# EAGLE schematic boiler_explorer (EAGLE 6.3)
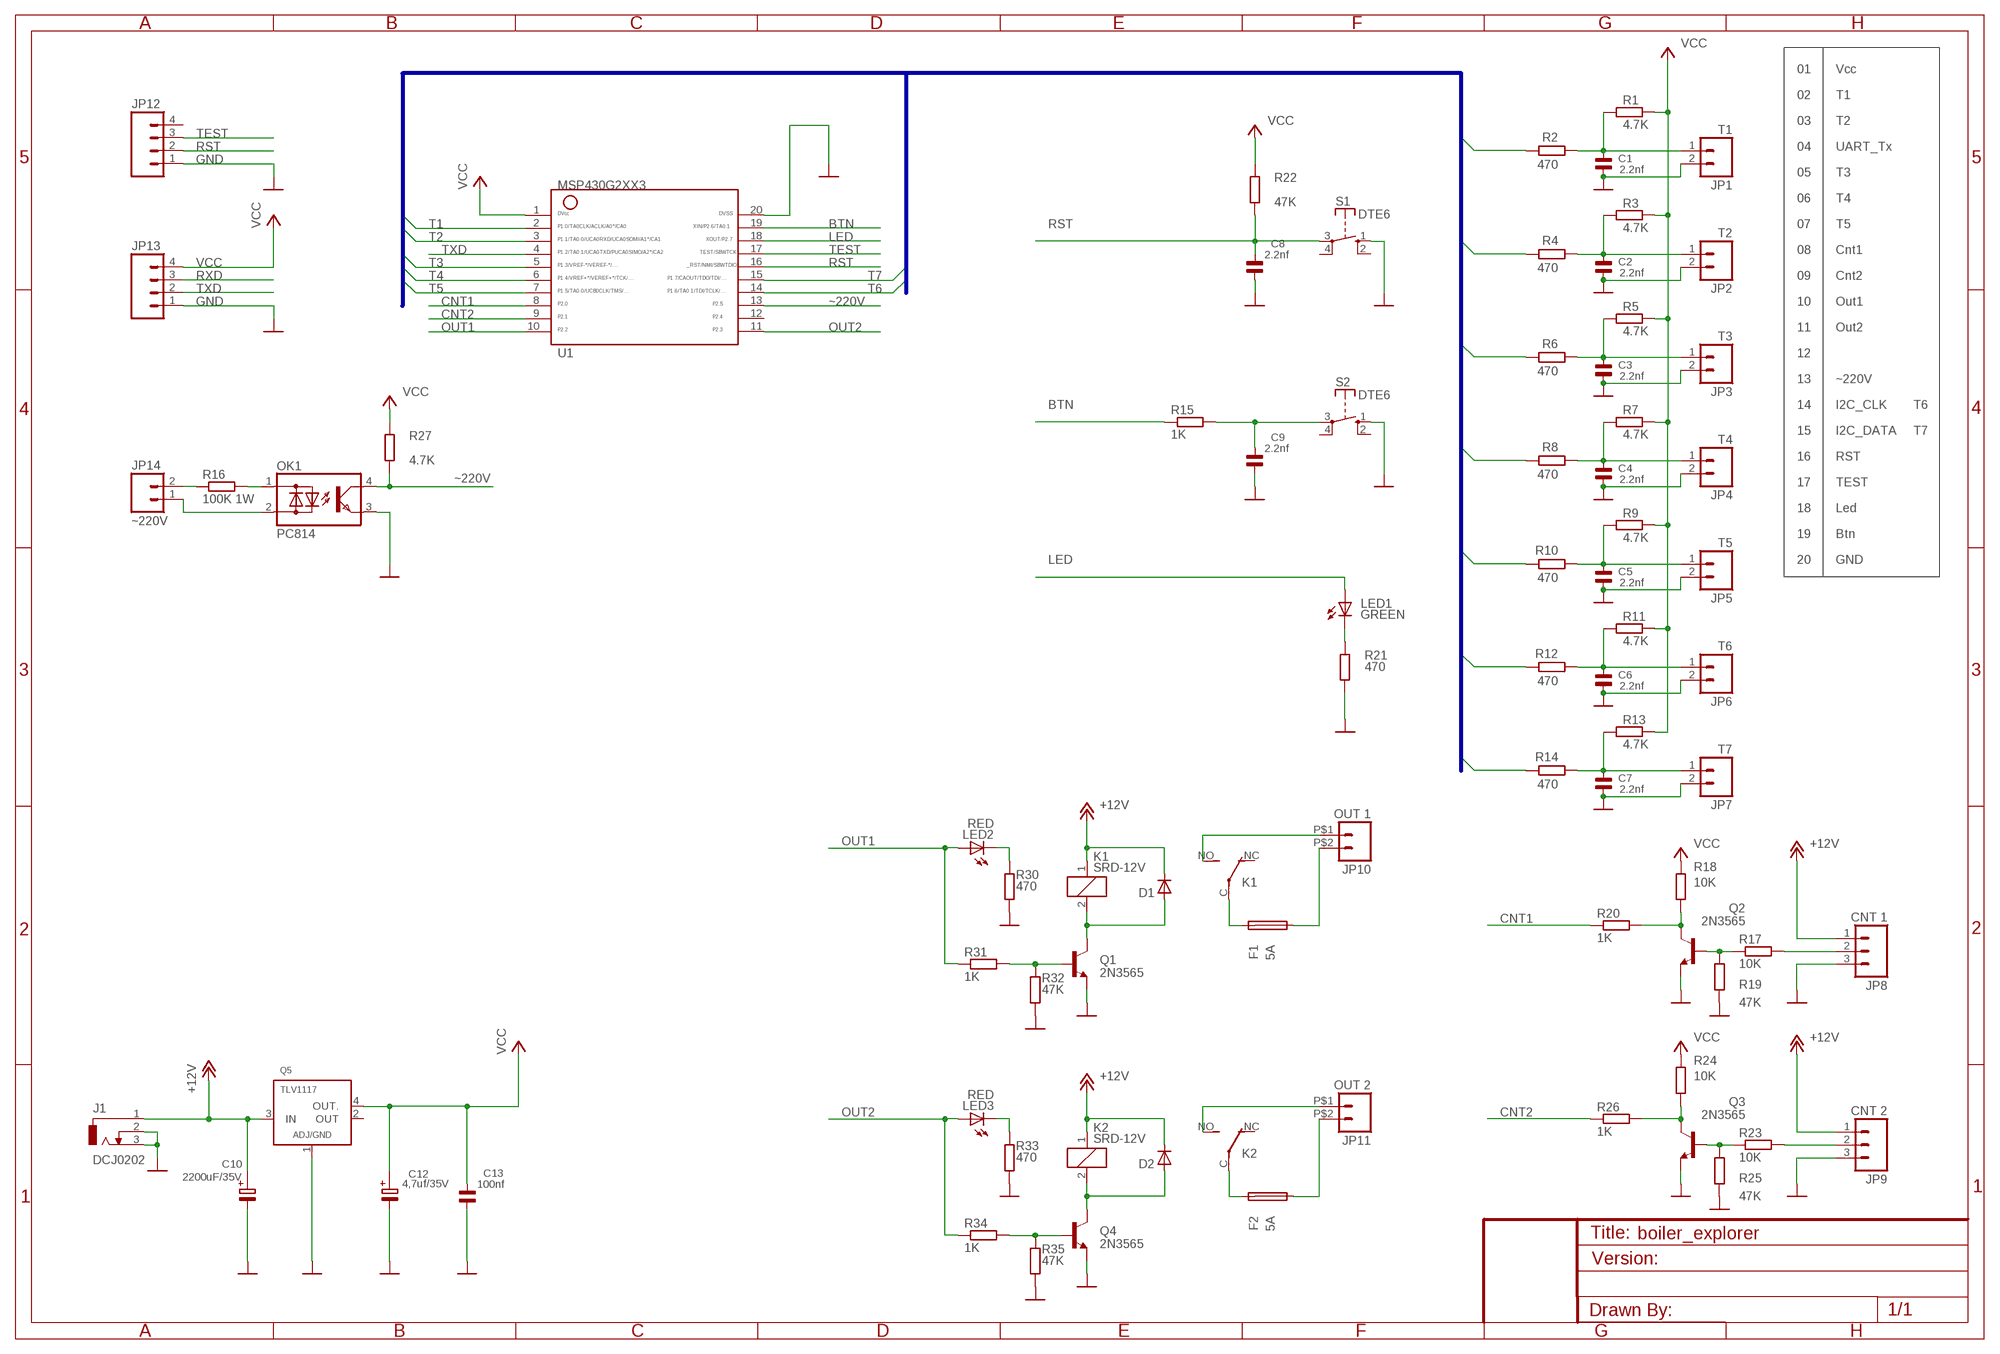
[diagram p0: schematic, sheet 1]

## Parts
C1  2.2nf  C5B2,5A  [C5B2,5A]
C2  2.2nf  C5B2,5A  [C5B2,5A]
C3  2.2nf  C5B2,5A  [C5B2,5A]
C4  2.2nf  C5B2,5A  [C5B2,5A]
C5  2.2nf  C5B2,5A  [C5B2,5A]
C6  2.2nf  C5B2,5A  [C5B2,5A]
C7  2.2nf  C5B2,5A  [C5B2,5A]
C8  2.2nf  C5B2,5A  [C5B2,5A]
C9  2.2nf  C5B2,5A  [C5B2,5A]
C10  2200uF/35V  E35-16  [E35-16]
C12  4,7uf/35V  E2-5@1  [E2,5-5]
C13  100nf  C5B2,5A  [C5B2,5A]
D1  DIODE-SMB  [SMB]
D2  DIODE-SMB  [SMB]
F1  5A  FUSEBLANK_5X20MM  [FUSE_HOLDER_5X20MM]
F2  5A  FUSEBLANK_5X20MM  [FUSE_HOLDER_5X20MM]
J1  DCJ0202  [DCJ0202]
JP1  T1  M025MM  [SCREWTERMINAL-5MM-2]
JP2  T2  M025MM  [SCREWTERMINAL-5MM-2]
JP3  T3  M025MM  [SCREWTERMINAL-5MM-2]
JP4  T4  M025MM  [SCREWTERMINAL-5MM-2]
JP5  T5  M025MM  [SCREWTERMINAL-5MM-2]
JP6  T6  M025MM  [SCREWTERMINAL-5MM-2]
JP7  T7  M025MM  [SCREWTERMINAL-5MM-2]
JP8  CNT 1  M03POLAR_LOCK  [MOLEX-1X3_LOCK]
JP9  CNT 2  M03POLAR_LOCK  [MOLEX-1X3_LOCK]
JP10  OUT 1  M02PTH2  [1X02_BIG]
JP11  OUT 2  M02PTH2  [1X02_BIG]
JP12  M04PTH  [1X04]
JP13  M04PTH  [1X04]
JP14  ~220V  M025MM  [SCREWTERMINAL-5MM-2]
K1  SRD-12V  JS-M1-12V-5  [SRD]
K2  SRD-12V  JS-M1-12V-5  [SRD]
LED1  GREEN  LEDCHIP-LED0805  [CHIP-LED0805]
LED2  RED  LEDCHIP-LED0805  [CHIP-LED0805]
LED3  RED  LEDCHIP-LED0805  [CHIP-LED0805]
OK1  PC814  [DIL04]
Q1  2N3565  [TO92]
Q2  2N3565  [TO92]
Q3  2N3565  [TO92]
Q4  2N3565  [TO92]
Q5  TLV1117  [SOT223-4]
R1  4.7K  R-EU_R0805  [R0805]
R2  470  R-EU_R0805  [R0805]
R3  4.7K  R-EU_R0805  [R0805]
R4  470  R-EU_R0805  [R0805]
R5  4.7K  R-EU_R0805  [R0805]
R6  470  R-EU_R0805  [R0805]
R7  4.7K  R-EU_R0805  [R0805]
R8  470  R-EU_R0805  [R0805]
R9  4.7K  R-EU_R0805  [R0805]
R10  470  R-EU_R0805  [R0805]
R11  4.7K  R-EU_R0805  [R0805]
R12  470  R-EU_R0805  [R0805]
R13  4.7K  R-EU_R0805  [R0805]
R14  470  R-EU_R0805  [R0805]
R15  1K  R-EU_R0805  [R0805]
R16  100K 1W  R-EU_R0805  [R0805]
R17  10K  R-EU_R0805  [R0805]
R18  10K  R-EU_R0805  [R0805]
R19  47K  R-EU_R0805  [R0805]
R20  1K  R-EU_R0805  [R0805]
R21  470  R-EU_R0805  [R0805]
R22  47K  R-EU_R0805  [R0805]
R23  10K  R-EU_R0805  [R0805]
R24  10K  R-EU_R0805  [R0805]
R25  47K  R-EU_R0805  [R0805]
R26  1K  R-EU_R0805  [R0805]
R27  4.7K  R-EU_R0805  [R0805]
R30  470  R-EU_R0805  [R0805]
R31  1K  R-EU_R0805  [R0805]
R32  47K  R-EU_R0805  [R0805]
R33  470  R-EU_R0805  [R0805]
R34  1K  R-EU_R0805  [R0805]
R35  47K  R-EU_R0805  [R0805]
S1  DTE6  [DTE6]
S2  DTE6  [DTE6]
U1  G2XX3---N20  [N20]

## Nets
+12V: C10.+ D1.C D2.C JP8.1 JP9.1 K1.1 K2.1 Q5.3(IN)
BTN: R15.1 U1.19
CNT1: R20.1 U1.8
CNT2: R26.1 U1.9
GND: C1.1 C2.1 C3.1 C4.1 C5.1 C6.1 C7.1 C8.1 C9.1 C10.- C12.- C13.1 J1.2 J1.3 JP1.2 JP2.2 JP3.2 JP4.2 JP5.2 JP6.2 JP7.2 JP8.3 JP9.3 JP13.1 OK1.3(E) Q1.3(E) Q2.3(E) Q3.3(E) Q4.3(E) Q5.1(ADJ/GND) R19.1 R21.1 R25.1 R30.1 R32.1 R33.1 R35.1 S1.1(S) S2.1(S) U1.20
LED: LED1.A U1.18
N$1: C2.2 JP2.1 R3.2 R4.2
N$2: C1.2 JP1.1 R1.2 R2.2
N$3: C3.2 JP3.1 R5.2 R6.2
N$4: C4.2 JP4.1 R7.2 R8.2
N$5: C5.2 JP5.1 R9.2 R10.2
N$6: C6.2 JP6.1 R11.2 R12.2
N$7: C7.2 JP7.1 R13.2 R14.2
N$8: Q1.2(B) R31.2 R32.2
N$9: D1.A K1.2 Q1.1(C)
N$10: JP10.P$1 K1.NO(2:S)
N$11: F1.2 K1.C(2:P)
N$12: F1.1 JP10.P$2
N$13: LED2.C R30.2
N$14: Q4.2(B) R34.2 R35.2
N$15: JP8.2 R17.2
N$16: Q2.2(B) R17.1 R19.2
N$17: Q2.1(C) R18.1 R20.2
N$18: JP9.2 R23.2
N$19: Q3.2(B) R23.1 R25.2
N$20: Q3.1(C) R24.1 R26.2
N$21: JP14.2 R16.1
N$22: C9.2 R15.2 S2.3(P)
N$23: LED1.C R21.2
N$24: D2.A K2.2 Q4.1(C)
N$25: JP11.P$1 K2.NO(2:S)
N$26: F2.2 K2.C(2:P)
N$27: F2.1 JP11.P$2
N$28: LED3.C R33.2
N$29: OK1.1(AC1) R16.2
N$30: J1.1
N$31: JP14.1 OK1.2(AC2)
OUT1: LED2.A R31.1 U1.10
OUT2: LED3.A R34.1 U1.11
RST: C8.2 R22.1 S1.3(P) U1.16
T1: R2.1 U1.2
T2: R4.1 U1.3
T3: R6.1 U1.5
T4: R8.1 U1.6
T5: R10.1 U1.7
T6: R12.1 U1.14
T7: R14.1 U1.15
TEST: U1.17
TXD: U1.4
VCC: C12.+ C13.2 Q5.4(OUT.) R1.1 R3.1 R5.1 R7.1 R9.1 R11.1 R13.1 R18.2 R22.2 R24.2 R27.2 U1.1
~220V: OK1.4(C) R27.1 U1.13
Unconnected: JP12.1 JP12.2 JP12.3 JP12.4 JP13.2 JP13.3 JP13.4 K1.NC(2:O) K2.NC(2:O) S1.2(S) S1.4(P) S2.2(S) S2.4(P) U1.12

## Buses
T[1..7]

## Notes on the sheet
- 01 | Vcc
- 02 | T1
- 03 | T2
- 04 | UART_Tx
- 05 | T3
- 06 | T4
- 07 | T5
- 08 | Cnt1
- 09 | Cnt2
- 10 | Out1
- 11 | Out2
- 12
- 13 | ~220V
- 14 | I2C_CLK | T6
- 15 | I2C_DATA | T7
- 16 | RST
- 17 | TEST
- 18 | Led
- 19 | Btn
- 20 | GND

## Power pins joined to a net without a drawn wire
OUT: Q5.2(OUT)

## Library data of the parts
C1-C9 C13 = CAP-WI:C5B2,5A
C10 = ELKO:E35-16
C12 = ELKO:E2-5@1
D1 D2 = diode:DIODE-: DIODE
F1 F2 = fuse:FUSE: Fuse; OC_FARNELL: unknown; OC_NEWARK: unknown
J1 = con-jack:DCJ0202: DC POWER JACK Source: DCJ0202.pdf; OC_FARNELL: unknown; OC_NEWARK: unknown
JP1-JP7 JP10 JP11 JP14 = SparkFun:M02: Header 2 Standard 2-pin 0.1" header. Use with straight break away headers (SKU : PRT-00116), right angle break away headers (PRT-00553), swiss pins (PRT-00743), machine pins (PRT-00117), and female headers (PRT-00115). Molex polarized connector foot print use with SKU : PRT-08233 with associated crimp pins and housings.
JP8 JP9 = SparkFun:M03: Header 3 Standard 3-pin 0.1" header. Use with straight break away headers (SKU : PRT-00116), right angle break away headers (PRT-00553), swiss pins (PRT-00743), machine pins (PRT-00117), and female headers (PRT-00115). Molex polarized connector foot print use with SKU : PRT-08232 with associated crimp pins and housings.
JP12 JP13 = SparkFun:M04: Header 4 Standard 4-pin 0.1" header. Use with straight break away headers (SKU : PRT-00116), right angle break away headers (PRT-00553), swiss pins (PRT-00743), machine pins (PRT-00117), and female headers (PRT-00115). Molex polarized connector foot print use with SKU : PRT-08231 with associated crimp pins and housings. 1MM SMD Version SKU: PRT-10208
K1 K2 = jlab:JS-M1*: SRD power relayy Source: http://www.spb-planeta.ru/pdf/srd.pdf; MF: FARNELL; MPN: JSM1-12V-5; OC_FARNELL: 910351; OC_NEWARK: 14J1764
LED1-LED3 = led:LED: LED OSRAM: - CHIPLED LG R971, LG N971, LY N971, LG Q971, LY Q971, LO R971, LY R971 LH N974, LH R974 LS Q976, LO Q976, LY Q976 LO Q996 - Hyper CHIPLED LW Q18S LB Q993, LB Q99A, LB R99A - SideLED LS A670, LO A670, LY A670, LG A670, LP A670 LB A673, LV A673, LT A673, LW A673 LH A674 LY A675 LS A676, LA A676, LO A676, LY A676, LW A676 LS A679, LY A679, LG A679 - Hyper Micro SIDELED® LS Y876, LA Y876, LO Y876, LY Y876 LT Y87S - SmartLED LW L88C, LW L88S LB L89C, LB L89S, LG L890 LS L89K, LO L89K, LY L89K LS L896, LA L896, LO L896, LY L896 - TOPLED LS T670, LO T670, LY T670, LG T670, LP T670 LSG T670, LSP T670, LSY T670, LOP T670, LYG T670 LG T671, LOG T671, LSG T671 LB T673, LV T673, LT T673, LW T673 LH T674 LS T676, LA T676, LO T676, LY T676, LB T676, LH T676, LSB T676, LW T676 LB T67C, LV T67C, LT T67C, LS T67K, LO T67K, LY T67K, LW E67C LS E67B, LA E67B, LO E67B, LY E67B, LB E67C, LV E67C, LT E67C LW T67C LS T679, LY T679, LG T679 LS T770, LO T770, LY T770, LG T770, LP T770 LB T773, LV T773, LT T773, LW T773 LH T774 LS E675, LA E675, LY E675, LS T675 LS T776, LA T776, LO T776, LY T776, LB T776 LHGB T686 LT T68C, LB T68C - Hyper Mini TOPLED® LB M676 - Mini TOPLED Santana® LG M470 LS M47K, LO M47K, LY M47K Source: http://www.osram.convergy.de LUXEON: - LUMILED® LXK2-PW12-R00, LXK2-PW12-S00, LXK2-PW14-U00, LXK2-PW14-V00 LXK2-PM12-R00, LXK2-PM12-S00, LXK2-PM14-U00 LXK2-PE12-Q00, LXK2-PE12-R00, LXK2-PE12-S00, LXK2-PE14-T00, LXK2-PE14-U00 LXK2-PB12-K00, LXK2-PB12-L00, LXK2-PB12-M00, LXK2-PB14-N00, LXK2-PB14-P00, LXK2-PB14-Q00 LXK2-PR12-L00, LXK2-PR12-M00, LXK2-PR14-Q00, LXK2-PR14-R00 LXK2-PD12-Q00, LXK2-PD12-R00, LXK2-PD12-S00 LXK2-PH12-R00, LXK2-PH12-S00 LXK2-PL12-P00, LXK2-PL12-Q00, LXK2-PL12-R00 Source: www.luxeon.com KINGBRIGHT: KA-3528ASYC Source: www.kingbright.com
OK1 = optocoupler:PC814: SHARP OPTO COUPLER; OC_FARNELL: 9707662; OC_NEWARK: unknown
Q1-Q4 = transistor-npn:2N3565: NPN Transistor
Q5 = ti-parts:TLV1117: LDO VOLTAGE REGULATOR
R1-R27 R30-R35 = rcl:R-EU_: RESISTOR, European symbol
S1 S2 = jlab:DT: 5x5 push button
U1 = TI_MSP430_v16:G2XX3---N20: MSP430G2XX1 PDIP (N) 20 Pin Package